# EAGLE schematic efuse (EAGLE 9.6.2)
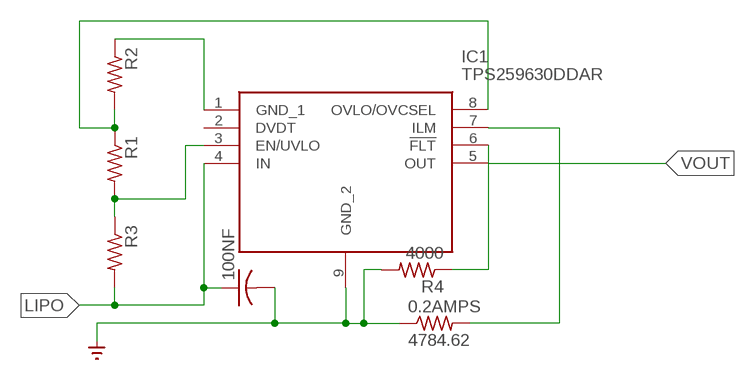
[diagram p0: schematic, sheet 1]

## Parts
0.2AMPS  4784.62  R-US_M0805  [M0805]
100NF  C-USC0805  [C0805]
IC1  TPS259630DDAR  [SOIC127P600X170-9N]
R1  R-US_M0805  [M0805]
R2  R-US_M0805  [M0805]
R3  R-US_M0805  [M0805]
R4  4000  R-US_R0805  [R0805]

## Nets
GND: 0.2AMPS.1 100NF.2 IC1.9(GND_2) R4.2 ; supply symbol labelled SUPPLY0_GND_
LIPO: 100NF.1 IC1.4(IN) R3.2
N$1: IC1.3(EN/UVLO) R1.2 R3.1
N$2: 0.2AMPS.2 IC1.7(ILM)
N$3: IC1.8(OVLO/OVCSEL) R1.1 R2.2
N$4: IC1.1(GND_1) R2.1
N$5: IC1.6(!FLT) R4.1
VOUT: IC1.5(OUT)
Unconnected: IC1.2(DVDT)

## Library data of the parts
0.2AMPS R1-R4 = adafruit:R-US_: RESISTOR, American symbol
100NF = adafruit:C-US: CAPACITOR, American symbol
IC1 = TPS259630DDAR:TPS259630DDAR: Hot Swap Voltage Controllers 2.7-19V 130MA-2A SURGE CLAMPING EFUSE Source: Datasheet <https://www.ti.com/lit/gpn/TPS2596>; DESCRIPTION: Hot Swap Voltage Controllers 2.7-19V 130MA-2A SURGE CLAMPING EFUSE; HEIGHT: 1.7mm; MANUFACTURER_NAME: Texas Instruments; MANUFACTURER_PART_NUMBER: TPS259630DDAR; MOUSER_PART_NUMBER: 595-TPS259630DDAR; MOUSER_PRICE-STOCK: https://www.mouser.co.uk/ProductDetail/Texas-Instruments/TPS259630DDAR?qs=T3oQrply3y%252BCA0rOFESTyA%3D%3D